# Altium schematic sheet Sheet_1_2020-09-21_08-20-19.schdoc
size 314 x 219 mm
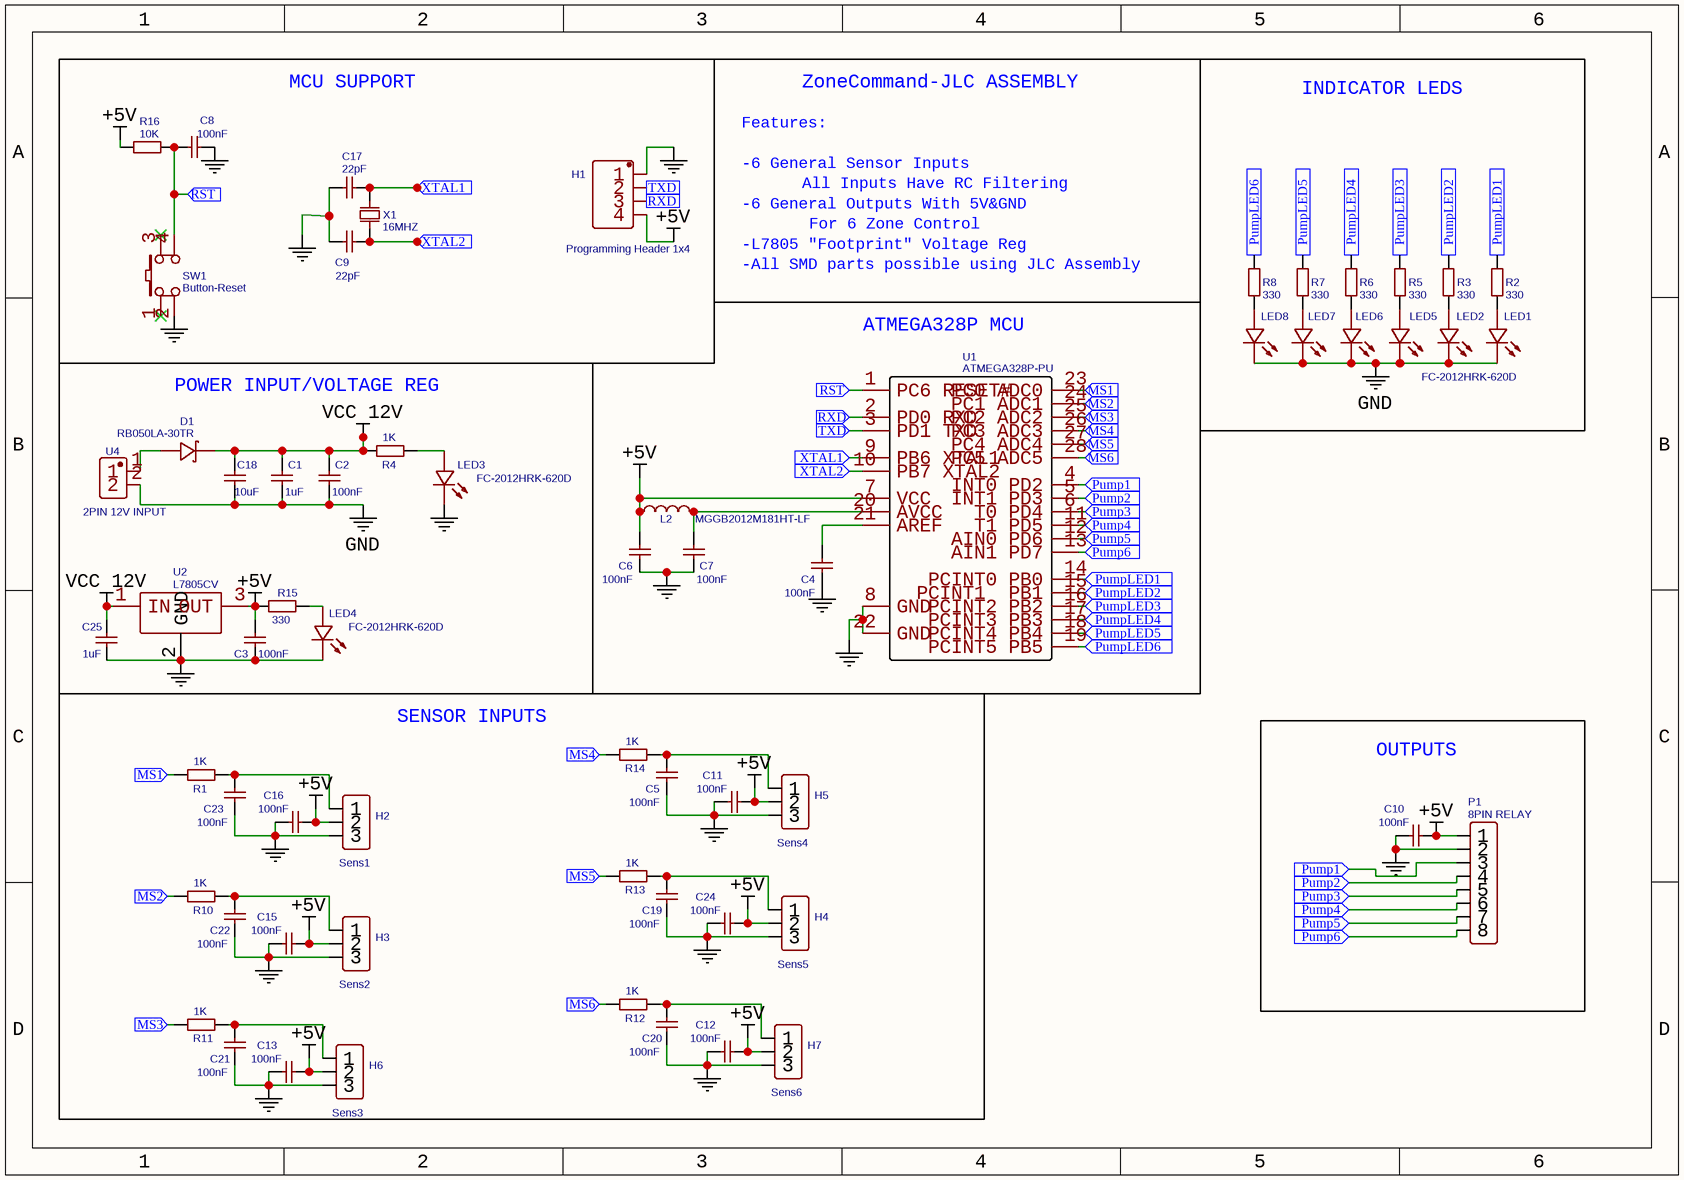
[diagram p0: Sheet_1_2020-09-21_08-20-19.schdoc]

## Parts
C1  1uF  [C0805]
C2  100nF  [C0805]
C3  100nF  [C0805]
C4  100nF  [C0805]
C5  100nF  [C0805]
C6  100nF  [C0805]
C7  100nF  [C0805]
C8  100nF  [C0805]
C9  22pF  [C0805]
C10  100nF  [C0805]
C11  100nF  [C0805]
C12  100nF  [C0805]
C13  100nF  [C0805]
C15  100nF  [C0805]
C16  100nF  [C0805]
C17  22pF  [C0805]
C18  10uF  [C0805]
C19  100nF  [C0805]
C20  100nF  [C0805]
C21  100nF  [C0805]
C22  100nF  [C0805]
C23  100nF  [C0805]
C24  100nF  [C0805]
C25  1uF  [C0805]
D1  RB050LA-30TR  [SOD-128_L3.7-W2.5-LS4.7-RD]
H1  Programming Header 1x4  [HDR-TH_4P-P2.54-V]
H2  Sens1  [HDR-TH_3P-P2.54-V]
H3  Sens2  [HDR-TH_3P-P2.54-V]
H4  Sens5  [HDR-TH_3P-P2.54-V]
H5  Sens4  [HDR-TH_3P-P2.54-V]
H6  Sens3  [HDR-TH_3P-P2.54-V]
H7  Sens6  [HDR-TH_3P-P2.54-V]
L2  MGGB2012M181HT-LF  [L0805]
LED1  FC-2012HRK-620D  [LED0805-RD]
LED2  FC-2012HRK-620D  [LED0805-RD]  (value not drawn)
LED3  FC-2012HRK-620D  [LED0805-RD]
LED4  FC-2012HRK-620D  [LED0805-RD]
LED5  FC-2012HRK-620D  [LED0805-RD]  (value not drawn)
LED6  FC-2012HRK-620D  [LED0805-RD]  (value not drawn)
LED7  FC-2012HRK-620D  [LED0805-RD]  (value not drawn)
LED8  FC-2012HRK-620D  [LED0805-RD]  (value not drawn)
P1  8PIN RELAY  [HDR-TH_8P-P2.54-V]
R1  1K  [R0805]
R2  330  [R0805]
R3  330  [R0805]
R4  1K  [R0805]
R5  330  [R0805]
R6  330  [R0805]
R7  330  [R0805]
R8  330  [R0805]
R10  1K  [R0805]
R11  1K  [R0805]
R12  1K  [R0805]
R13  1K  [R0805]
R14  1K  [R0805]
R15  330  [R0805]
R16  10K  [R0805]
SW1  Button-Reset  [SW-TH_4PIN-L6.00-W6.00]
U1  ATMEGA328P-PU  [DIP-28_L34.6-W7.3-P2.54-LS10.2-BL]
U2  L7805CV  [TO-220-3_L10.0-W4.5-P2.54-L]
U4  2PIN 12V INPUT  [CONN-TH_DG500-5.08-02P-14-00A(H)]
X1  16MHZ  [HC-49S_L11.0-W4.4-P4.88]

## Blocks framed on the sheet
MCU SUPPORT: C8 C9 C17 H1 R16 SW1 X1
INDICATOR LEDS: LED1 LED2 LED5-LED8 R2 R3 R5-R8
POWER INPUT/VOLTAGE REG: C1-C3 C18 C25 D1 LED3 LED4 R4 R15 U2 U4
SENSOR INPUTS: C5 C11-C13 C15 C16 C19-C24 H2-H7 R1 R10-R14
OUTPUTS: C10 P1

## Ports
MS1 (in), MS2 (in), MS3 (in), MS4 (in), MS5 (in), MS6 (in), Pump1 (in), Pump2 (in), Pump3 (in), Pump4 (in), Pump5 (in), Pump6 (in), PumpLED1 (in), PumpLED2 (in), PumpLED3 (in), PumpLED4 (in), PumpLED5 (in), PumpLED6 (in), RST (in), RXD (in), TXD (in), XTAL1 (in), XTAL2 (in)

## Nets
+5V: C3.1 C6.1 C10.2 C11.2 C12.2 C13.2 C15.2 C16.2 C24.2 H1.4 H2.2 H3.2 H4.2 H5.2 H6.2 H7.2 L2.1 P1.1 R15.1 R16.1 U1.7(VCC) U2.3(OUT)
GND: C1.1 C2.2 C3.2 C4.2 C5.2 C6.2 C7.2 C8.2 C9.1 C10.1 C11.1 C12.1 C13.1 C15.1 C16.1 C17.1 C18.2 C19.2 C20.2 C21.2 C22.2 C23.2 C24.1 C25.1 H1.1 H2.3 H3.3 H4.3 H5.3 H6.3 H7.3 LED1.1(-) LED2.1(-) LED3.1(-) LED4.1(-) LED5.1(-) LED6.1(-) LED7.1(-) LED8.1(-) P1.2 SW1.2 U1.8(GND) U1.22(GND) U2.2(GND) U4.2
VCC 12V: C1.2 C2.1 C18.1 C25.2 D1.1(K) R4.1 U2.1(IN)
MS1: R1.1 U1.23(PC0_ADC0) ; port MS1
MS2: R10.1 U1.24(PC1_ADC1) ; port MS2
MS3: R11.1 U1.25(PC2_ADC2) ; port MS3
MS4: R14.1 U1.26(PC3_ADC3) ; port MS4
MS5: R13.1 U1.27(PC4_ADC4) ; port MS5
MS6: R12.1 U1.28(PC5_ADC5) ; port MS6
Pump1: P1.3 U1.4(INT0_PD2) ; port Pump1
Pump2: P1.4 U1.5(INT1_PD3) ; port Pump2
Pump3: P1.5 U1.6(T0_PD4) ; port Pump3
Pump4: P1.6 U1.11(T1_PD5) ; port Pump4
Pump5: P1.7 U1.12(AIN0_PD6) ; port Pump5
Pump6: P1.8 U1.13(AIN1_PD7) ; port Pump6
PumpLED1: R2.2 U1.14(PCINT0_PB0) ; port PumpLED1
PumpLED2: R3.2 U1.15(PCINT1__PB1) ; port PumpLED2
PumpLED3: R5.2 U1.16(PCINT2_PB2) ; port PumpLED3
PumpLED4: R6.2 U1.17(PCINT3_PB3) ; port PumpLED4
PumpLED5: R7.2 U1.18(PCINT4_PB4) ; port PumpLED5
PumpLED6: R8.2 U1.19(PCINT5_PB5) ; port PumpLED6
RST: C8.1 R16.2 SW1.4 U1.1(PC6_RESET#) ; port RST
RXD: H1.3 U1.2(PD0_RXD) ; port RXD
TXD: H1.2 U1.3(PD1_TXD) ; port TXD
XTAL1: C17.2 U1.9(PB6_XTAL1) X1.1(OSC1) ; port XTAL1
XTAL2: C9.2 U1.10(PB7_XTAL2) X1.2(OSC2) ; port XTAL2
NetC4_1: C4.1 U1.21(AREF)
NetC5_1: C5.1 H5.1 R14.2
NetC7_1: C7.1 L2.2 U1.20(AVCC)
NetC19_1: C19.1 H4.1 R13.2
NetC20_1: C20.1 H7.1 R12.2
NetC21_1: C21.1 H6.1 R11.2
NetC22_1: C22.1 H3.1 R10.2
NetC23_1: C23.1 H2.1 R1.2
NetD1_2: D1.2(A) U4.1
NetLED1_2: LED1.2(+) R2.1
NetLED2_2: LED2.2(+) R3.1
NetLED3_2: LED3.2(+) R4.2
NetLED4_2: LED4.2(+) R15.2
NetLED5_2: LED5.2(+) R5.1
NetLED6_2: LED6.2(+) R6.1
NetLED7_2: LED7.2(+) R7.1
NetLED8_2: LED8.2(+) R8.1

Not connected (* = marked no-connect by the designer): SW1 1* 3*

## Notes on the sheet
- ZoneCommand-JLC ASSEMBLY
- -6 General Sensor Inputs
- Features:
- All Inputs Have RC Filtering
- -L7805 "Footprint" Voltage Reg
- -6 General Outputs With 5V&GND
- For 6 Zone Control
- -All SMD parts possible using JLC Assembly
- ATMEGA328P MCU

## Library data of the parts
C1 C25 = 1uF: BOM_Manufacturer Part: CL21B105KBFNNNE; BOM_Manufacturer: SAMSUNG; nameAlias: Capacitance; SMT Type: Basic; BOM_Supplier: LCSC; BOM_LCSC Assembly: Yes; BOM_Supplier Part: C28323; spicePre: C; spiceSymbolName: CL21B105KBFNNNE
C2-C8 C10-C13 C15 C16 C19-C24 = 100nF: BOM_Manufacturer Part: CC0805KRX7R9BB104; BOM_Manufacturer: YAGEO; nameAlias: Capacitance; SMT Type: Basic; BOM_Supplier: LCSC; BOM_LCSC Assembly: Yes; BOM_Supplier Part: C49678; spicePre: C; spiceSymbolName: CC0805KRX7R9BB104
C9 C17 = 22pF: BOM_Manufacturer Part: CL21C220JBANNNC; BOM_Manufacturer: SAMSUNG; nameAlias: Capacitance; SMT Type: Basic; BOM_Supplier: LCSC; BOM_LCSC Assembly: Yes; BOM_Supplier Part: C1804; spicePre: C; spiceSymbolName: CL21C220JBANNNC
C18 = 10uF: BOM_Manufacturer Part: CL21A106KAYNNNE; BOM_Manufacturer: SAMSUNG; nameAlias: Capacitance; SMT Type: Basic; BOM_Supplier: LCSC; BOM_LCSC Assembly: Yes; BOM_Supplier Part: C15850; spicePre: C; spiceSymbolName: CL21A106KAYNNNE
D1 = RB050LA-30TR: BOM_Manufacturer: ROHM Semicon; Contributor: LCSC; SMT Type: Extend; BOM_Supplier: LCSC; BOM_Supplier Part: C162057; BOM_Manufacturer Part: RB050LA-30TR; BOM_LCSC Assembly: Yes; spicePre: D; spiceSymbolName: RB050LA-30TR
H1 = Programming Header 1x4: BOM_Manufacturer: Ckmtw; BOM_Manufacturer Part: 210S-1*4P L=11.6MMGold-plated black; Contributor: LCSC; Package Display: No; BOM_Supplier: LCSC; BOM_Supplier Part: C124378; spicePre: H; spiceSymbolName: Header-Male-2.54_1x4
H2 = Sens1: BOM_Manufacturer: BOOMELE; BOM_Manufacturer Part: Header2.54mm 1*3P; BOM_Supplier: LCSC; image: //image.lceda.cn/szlcsc/C49257.jpg; BOM_Supplier Part: C49257; spicePre: H; spiceSymbolName: Header-Male-2.54_1x3
H3 = Sens2: BOM_Manufacturer: BOOMELE; BOM_Manufacturer Part: Header2.54mm 1*3P; BOM_Supplier: LCSC; image: //image.lceda.cn/szlcsc/C49257.jpg; BOM_Supplier Part: C49257; spicePre: H; spiceSymbolName: Header-Male-2.54_1x3
H4 = Sens5: BOM_Manufacturer: BOOMELE; BOM_Manufacturer Part: Header2.54mm 1*3P; BOM_Supplier: LCSC; image: //image.lceda.cn/szlcsc/C49257.jpg; BOM_Supplier Part: C49257; spicePre: H; spiceSymbolName: Header-Male-2.54_1x3
H5 = Sens4: BOM_Manufacturer: BOOMELE; BOM_Manufacturer Part: Header2.54mm 1*3P; BOM_Supplier: LCSC; image: //image.lceda.cn/szlcsc/C49257.jpg; BOM_Supplier Part: C49257; spicePre: H; spiceSymbolName: Header-Male-2.54_1x3
H6 = Sens3: BOM_Manufacturer: BOOMELE; BOM_Manufacturer Part: Header2.54mm 1*3P; BOM_Supplier: LCSC; image: //image.lceda.cn/szlcsc/C49257.jpg; BOM_Supplier Part: C49257; spicePre: H; spiceSymbolName: Header-Male-2.54_1x3
H7 = Sens6: BOM_Manufacturer: BOOMELE; BOM_Manufacturer Part: Header2.54mm 1*3P; BOM_Supplier: LCSC; image: //image.lceda.cn/szlcsc/C49257.jpg; BOM_Supplier Part: C49257; spicePre: H; spiceSymbolName: Header-Male-2.54_1x3
L2 = MGGB2012M181HT-LF: BOM_Manufacturer: microgate; Contributor: LCSC; BOM_Supplier: LCSC; BOM_Supplier Part: C486339; BOM_Manufacturer Part: MGGB2012M181HT-LF; spicePre: L; spiceSymbolName: MGGB2012M181HT-LF
LED1-LED8 = FC-2012HRK-620D: BOM_Manufacturer: NATIONSTAR; SMT Type: Basic; BOM_Supplier: LCSC; BOM_Manufacturer Part: FC-2012HRK-620D; image: //image.lceda.cn/szlcsc/C84256.jpg; BOM_Supplier Part: C84256; BOM_LCSC Assembly: Yes; spicePre: L; spiceSymbolName: FC-2012HRK-620D
P1 = 8PIN RELAY: BOM_Manufacturer: BOOMELE; BOM_Manufacturer Part: Female headerHDR1X8-2.54; BOM_Supplier: LCSC; BOM_Supplier Part: C27438; spicePre: P; spiceSymbolName: Header-Female-2.54_1x8
R1 R4 R10-R14 = 1K: BOM_Manufacturer: UniOhm; BOM_Manufacturer Part: 0805W8F1001T5E; nameAlias: Resistance (Ohms); SMT Type: Basic; BOM_Supplier: LCSC; BOM_LCSC Assembly: Yes; BOM_Supplier Part: C17513; spicePre: R; spiceSymbolName: 0805W8F1001T5E
R2 R3 R5-R8 R15 = 330: BOM_Manufacturer: UniOhm; BOM_Manufacturer Part: 0805W8F3300T5E; nameAlias: Resistance (Ohms); SMT Type: Basic; BOM_Supplier: LCSC; BOM_LCSC Assembly: Yes; BOM_Supplier Part: C17630; spicePre: R; spiceSymbolName: 0805W8F3300T5E
R16 = 10K: BOM_Manufacturer: UniOhm; BOM_Manufacturer Part: 0805W8F1002T5E; nameAlias: Resistance (Ohms); SMT Type: Basic; BOM_Supplier: LCSC; BOM_LCSC Assembly: Yes; BOM_Supplier Part: C17414; spicePre: R; spiceSymbolName: 0805W8F1002T5E
SW1 = Button-Reset: BOM_Manufacturer: BBJ; BOM_Manufacturer Part: Switch,6*6*6Plastic head,260G, 0.25mm,Straight line; BOM_Supplier Part: C71836; BOM_Supplier: LCSC; spicePre: S; spiceSymbolName: Button-6x6x6mm
U1 = ATMEGA328P-PU: BOM_Manufacturer: MICROCHIP; sourceId: Oic6oiASL; Contributor: LCSC; timeStamp: 1451725987; BOM_Supplier: LCSC; BOM_Manufacturer Part: ATMEGA328P-PU; image: //image.lceda.cn/szlcsc/C33901.jpg; BOM_Supplier Part: C33901; spicePre: U; spiceSymbolName: ATMEGA328P-PU
U2 = L7805CV: BOM_Manufacturer: STMicroelectronics; BOM_Supplier: LCSC; BOM_Manufacturer Part: L7805CV; BOM_Supplier Part: C111887; spicePre: U; spiceSymbolName: L7805CV
U4 = 2PIN 12V INPUT: BOM_Manufacturer: DEGSON; BOM_Manufacturer Part: DG500-5.08-02P-14-00A(H); Contributor: LCSC; BOM_Supplier: LCSC; BOM_Supplier Part: C691859; spicePre: U; spiceSymbolName: DG500-5.08-02P-14-00A(H)
X1 = 16MHZ: BOM_Manufacturer: XTY; BOM_Manufacturer Part: 5S0-1600A1620-00; nameAlias: Value; Contributor: LCSC; BOM_Supplier: LCSC; BOM_Supplier Part: C389708; spicePre: X; spiceSymbolName: 5S0-1600A1620-00